# EAGLE design final_tank (EAGLE 9.6.2)
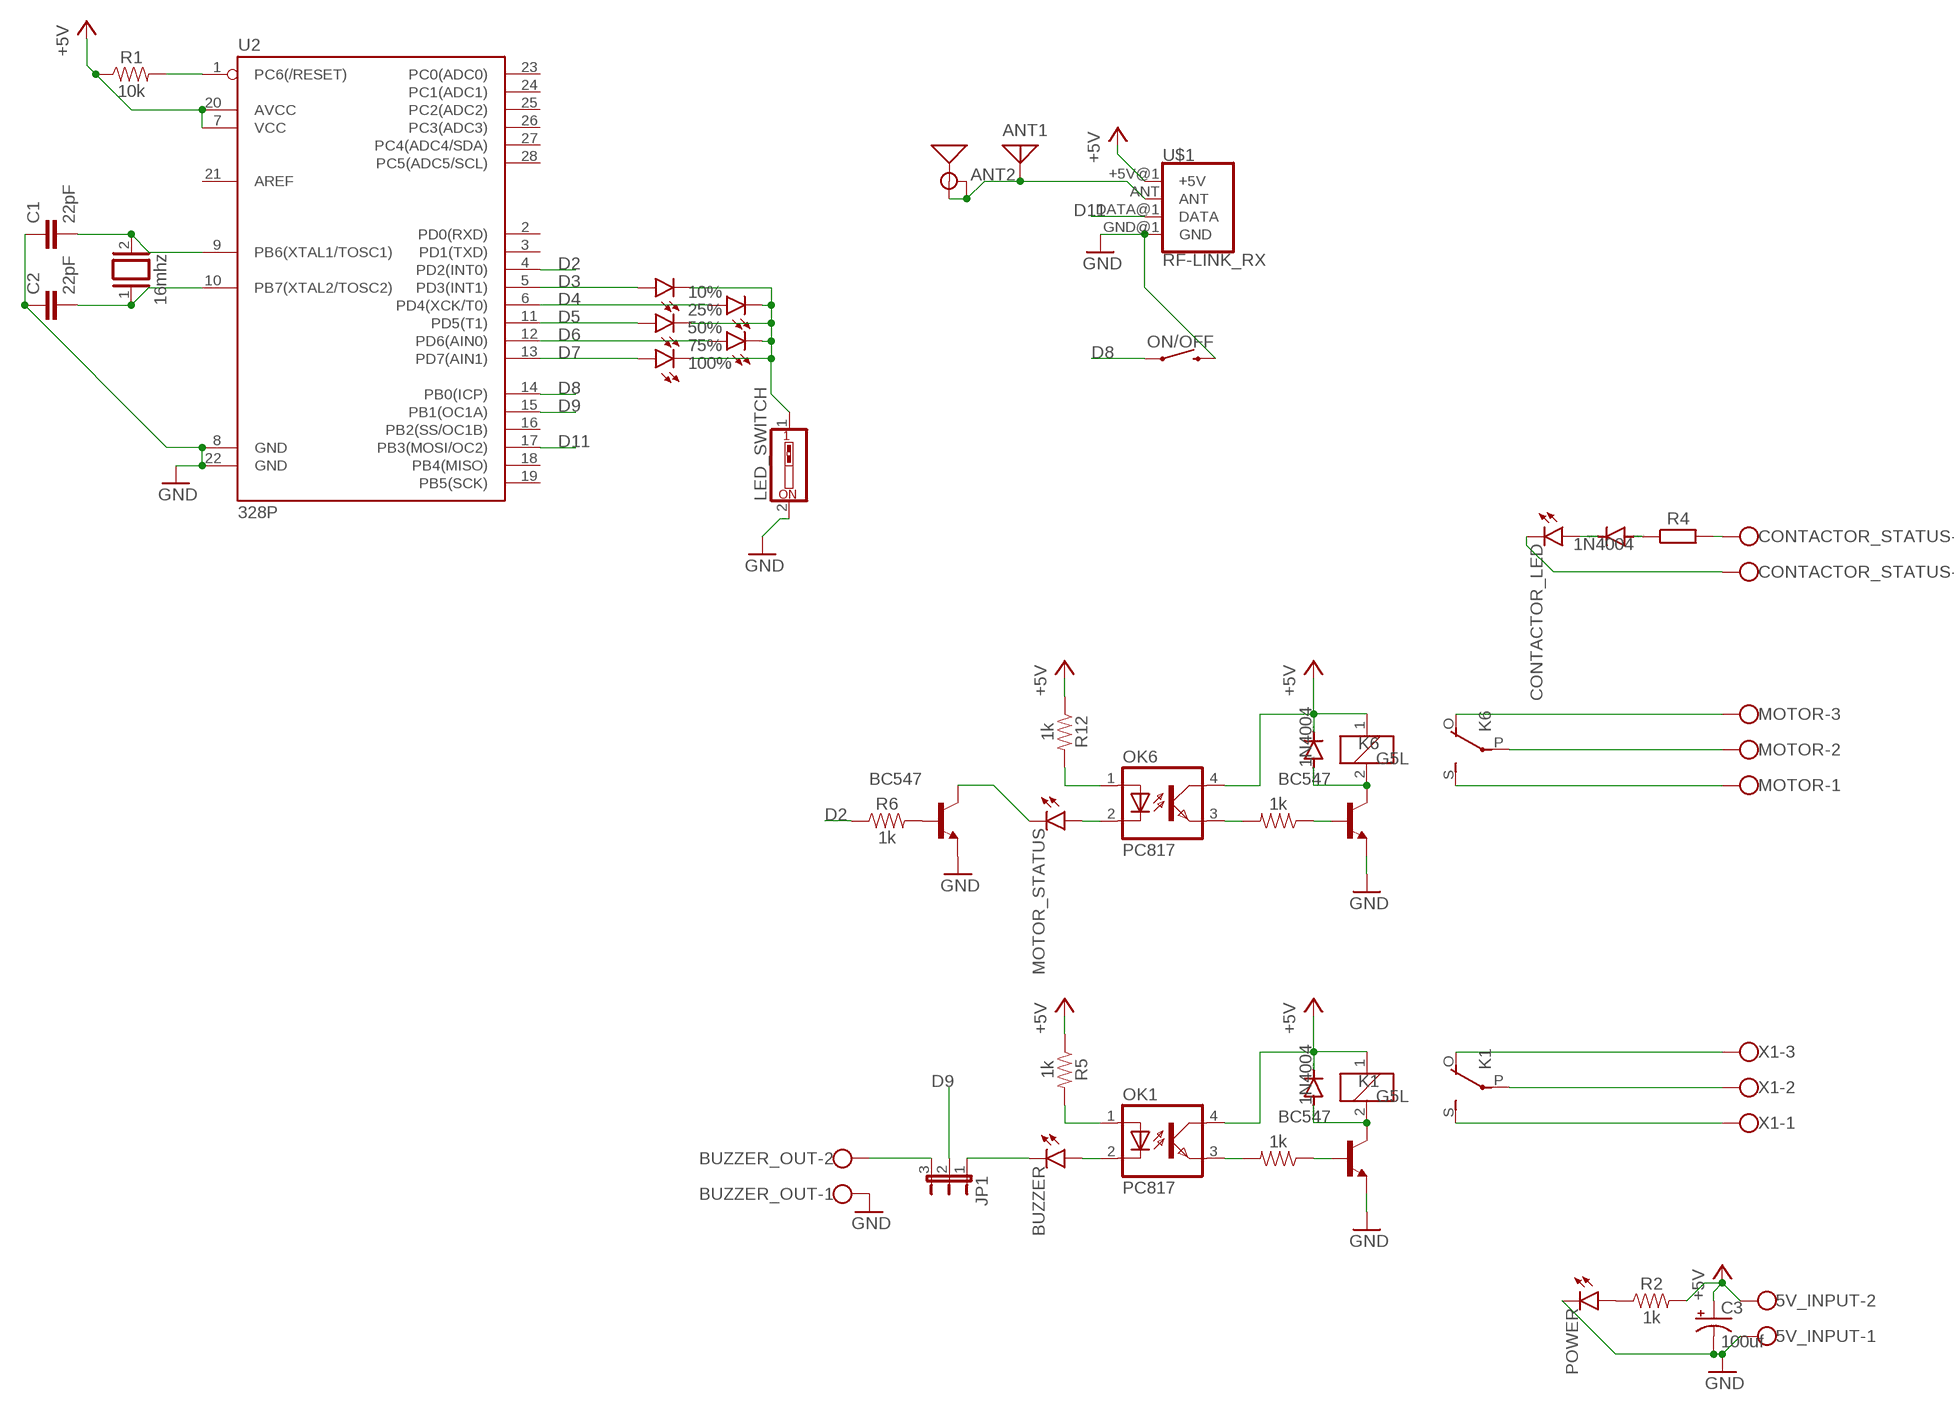
[diagram p0: schematic, sheet 1]

## Parts
5V_INPUT  W237-102  [W237-102]
10%  LED3MM  [LED3MM]
25%  LED3MM  [LED3MM]
50%  LED3MM  [LED3MM]
75%  LED3MM  [LED3MM]
100%  LED3MM  [LED3MM]
ANT1  ANTENNA  [PAD-01]
ANT2  ANTENNA-GROUNDEDTRACE-15.2MM  [TRACE_ANTENNA_2.4GHZ_15.2MM]
BUZZER  LED3MM  [LED3MM]
BUZZER_OUT  W237-102  [W237-102]
C1  22pF  22PF-PTH-2.54MM-200V-5%  [CAP-PTH-2.54]
C2  22pF  22PF-PTH-2.54MM-200V-5%  [CAP-PTH-2.54]
C3  100uf  1000UF-RADIAL-5MM-25V-20%  [CPOL-RADIAL-5MM-10MM]
CONTACTOR_LED  LED3MM  [LED3MM]
CONTACTOR_STATUS  W237-102  [W237-102]
D1  1N4004  [DO41-10]
D2  1N4004  [DO41-10]
D6  1N4004  [DO41-10]
JP1  JP2E  [JP2]
K1  G5L  [G5LE]
K6  G5L  [G5LE]
LED_SWITCH  SW_DIP-1  [EDG-01]
MOTOR  W237-103  [W237-103]
MOTOR_STATUS  LED3MM  [LED3MM]
OK1  PC817  [DIL04]
OK6  PC817  [DIL04]
ON/OFF  MOMENTARY-SWITCH-SPST-PTH-6.0MM  [TACTILE_SWITCH_PTH_6.0MM]
POWER  LED3MM  [LED3MM]
Q1  16mhz  XTAL/S  [QS]
R1  10k  1KOHM-HORIZ-1/4W-5%  [AXIAL-0.3]
R2  1k  1KOHM-HORIZ-1/4W-1%  [AXIAL-0.3]
R3  1k  1KOHM-HORIZ-1/4W-1%  [AXIAL-0.3]
R4  R_AXIAL-11.7MM-PITCH  [RESAD1176W63L850D250B]
R5  1k  1KOHM-HORIZ-1/4W-1%  [AXIAL-0.3]
R6  1k  1KOHM-HORIZ-1/4W-1%  [AXIAL-0.3]
R11  1k  1KOHM-HORIZ-1/4W-1%  [AXIAL-0.3]
R12  1k  1KOHM-HORIZ-1/4W-1%  [AXIAL-0.3]
T1  BC547  [TO92]
T2  BC547  [TO92]
T6  BC547  [TO92]
U2  328P  ATMEGA328P_PDIP  [DIP28]
U$1  RF-LINK_RX  [RF-LINK_RX]
X1  W237-103  [W237-103]

## Nets
+5V: 5V_INPUT.2 C3.+ R1.P$1 R2.P$2 U2.7(VCC) U2.20(AVCC) U$1.+5V@1(+5V)
D2: R6.P$1 U2.4(PD2(INT0))
D3: 10%.A U2.5(PD3(INT1))
D4: 25%.A U2.6(PD4(XCK/T0))
D5: 50%.A U2.11(PD5(T1))
D6: 75%.A U2.12(PD6(AIN0))
D7: 100%.A U2.13(PD7(AIN1))
D8: ON/OFF.1 U2.14(PB0(ICP))
D9: JP1.2 U2.15(PB1(OC1A))
D11: U2.17(PB3(MOSI/OC2)) U$1.DATA@1(DATA)
GND: 5V_INPUT.1 BUZZER_OUT.1 C1.1 C2.1 C3.- LED_SWITCH.2 ON/OFF.3 POWER.K(C) T1.1(E) T2.1(E) T6.1(E) U2.8(GND) U2.22(GND) U$1.GND@1(GND)
N$1: R1.P$2 U2.1(PC6(/RESET))
N$2: C1.2 Q1.2 U2.9(PB6(XTAL1/TOSC1))
N$3: C2.2 Q1.1 U2.10(PB7(XTAL2/TOSC2))
N$4: K6.P(2:P) MOTOR.2
N$5: POWER.A R2.P$1
N$6: D2.C D6.C K1.1 K6.1 OK1.4(COL) OK6.4(COL) R5.P$1 R12.P$1 ; supply symbol labelled +5V
N$7: D1.A R4.1
N$8: CONTACTOR_LED.A D1.C
N$9: CONTACTOR_STATUS.2 R4.2
N$10: CONTACTOR_LED.K(C) CONTACTOR_STATUS.1
N$11: 10%.K(C) 25%.K(C) 50%.K(C) 75%.K(C) 100%.K(C) LED_SWITCH.1
N$12: ANT1.1 ANT2.ANT(SIGNAL) ANT2.GND U$1.ANT
N$13: D2.A K1.2 T1.3(C)
N$14: R3.P$1 T1.2(B)
N$15: OK1.3(EMIT) R3.P$2
N$16: BUZZER.A OK1.2(C)
N$17: OK1.1(A) R5.P$2
N$18: K1.O(2:O) X1.3
N$19: K1.S(2:S) X1.1
N$20: K1.P(2:P) X1.2
N$21: R6.P$2 T2.2(B)
N$22: MOTOR_STATUS.K(C) T2.3(C)
N$23: BUZZER_OUT.2 JP1.3
N$24: BUZZER.K(C) JP1.1
N$43: D6.A K6.2 T6.3(C)
N$44: R11.P$1 T6.2(B)
N$45: OK6.3(EMIT) R11.P$2
N$46: MOTOR_STATUS.A OK6.2(C)
N$47: OK6.1(A) R12.P$2
N$49: K6.O(2:O) MOTOR.3
N$50: K6.S(2:S) MOTOR.1
Unconnected: U2.2(PD0(RXD)) U2.3(PD1(TXD)) U2.16(PB2(SS/OC1B)) U2.18(PB4(MISO)) U2.19(PB5(SCK)) U2.21(AREF) U2.23(PC0(ADC0)) U2.24(PC1(ADC1)) U2.25(PC2(ADC2)) U2.26(PC3(ADC3)) U2.27(PC4(ADC4/SDA)) U2.28(PC5(ADC5/SCL))

## Library data of the parts
5V_INPUT BUZZER_OUT CONTACTOR_STATUS = con-wago-500:W237-102: WAGO SCREW CLAMP; MPN: 237-102; OC_FARNELL: unknown; OC_NEWARK: 70K9898
10% 25% 50% 75% 100% BUZZER CONTACTOR_LED MOTOR_STATUS POWER = led:LED: LED OSRAM: - CHIPLED LG R971, LG N971, LY N971, LG Q971, LY Q971, LO R971, LY R971 LH N974, LH R974 LS Q976, LO Q976, LY Q976 LO Q996 - Hyper CHIPLED LW Q18S LB Q993, LB Q99A, LB R99A - SideLED LS A670, LO A670, LY A670, LG A670, LP A670 LB A673, LV A673, LT A673, LW A673 LH A674 LY A675 LS A676, LA A676, LO A676, LY A676, LW A676 LS A679, LY A679, LG A679 - Hyper Micro SIDELED® LS Y876, LA Y876, LO Y876, LY Y876 LT Y87S - SmartLED LW L88C, LW L88S LB L89C, LB L89S, LG L890 LS L89K, LO L89K, LY L89K LS L896, LA L896, LO L896, LY L896 - TOPLED LS T670, LO T670, LY T670, LG T670, LP T670 LSG T670, LSP T670, LSY T670, LOP T670, LYG T670 LG T671, LOG T671, LSG T671 LB T673, LV T673, LT T673, LW T673 LH T674 LS T676, LA T676, LO T676, LY T676, LB T676, LH T676, LSB T676, LW T676 LB T67C, LV T67C, LT T67C, LS T67K, LO T67K, LY T67K, LW E67C LS E67B, LA E67B, LO E67B, LY E67B, LB E67C, LV E67C, LT E67C LW T67C LS T679, LY T679, LG T679 LS T770, LO T770, LY T770, LG T770, LP T770 LB T773, LV T773, LT T773, LW T773 LH T774 LS E675, LA E675, LY E675, LS T675 LS T776, LA T776, LO T776, LY T776, LB T776 LHGB T686 LT T68C, LB T68C - Hyper Mini TOPLED® LB M676 - Mini TOPLED Santana® LG M470 LS M47K, LO M47K, LY M47K Source: http://www.osram.convergy.de LUXEON: - LUMILED® LXK2-PW12-R00, LXK2-PW12-S00, LXK2-PW14-U00, LXK2-PW14-V00 LXK2-PM12-R00, LXK2-PM12-S00, LXK2-PM14-U00 LXK2-PE12-Q00, LXK2-PE12-R00, LXK2-PE12-S00, LXK2-PE14-T00, LXK2-PE14-U00 LXK2-PB12-K00, LXK2-PB12-L00, LXK2-PB12-M00, LXK2-PB14-N00, LXK2-PB14-P00, LXK2-PB14-Q00 LXK2-PR12-L00, LXK2-PR12-M00, LXK2-PR14-Q00, LXK2-PR14-R00 LXK2-PD12-Q00, LXK2-PD12-R00, LXK2-PD12-S00 LXK2-PH12-R00, LXK2-PH12-S00 LXK2-PL12-P00, LXK2-PL12-Q00, LXK2-PL12-R00 Source: www.luxeon.com KINGBRIGHT: KA-3528ASYC Source: www.kingbright.com
ANT1 = discrete:ANTENNA: Antenna
ANT2 = SparkFun-RF:ANTENNA-GROUNDED: Antenna w/ Ground Connection 2.4GHz antennae with signal and ground terminals. TRACE_ANTENNA_2.4GHZ_15.2MM - Meander Trace antenna 15.2 x 5.7mm footprint Based on layout from TI app note AN043 <http://www.ti.com/lit/an/swra117d/swra117d.pdf>. TRACE_ANTENNA_2.4GHZ_25.7MM - Inverted F trace antenna 25.7 x 7.5 mm footprint. Based on layout from TI design note DN0007 <http://www.ti.com/lit/an/swru120b/swru120b.pdf>.
C1 C2 = SparkFun-Capacitors:22PF: 22pF ceramic capacitors A capacitor is a passive two-terminal electrical component used to store electrical energy temporarily in an electric field.; PROD_ID: CAP-09128
C3 = SparkFun-Capacitors:1000UF: 1,000µF/1mF ceramic capacitors A capacitor is a passive two-terminal electrical component used to store electrical energy temporarily in an electric field. CAP-08070; PROD_ID: CAP-09538; VALUE: 1mF
D1 D2 D6 = diode:1N4004: DIODE general purpose rectifier, 1 A
JP1 = jumper:JP2E: JUMPER
K1 K6 = relay:G5L: RELAY 1 x switch, 10 A/120 V AC, 8 A/30 V ADC, Omron; OC_FARNELL: unknown; OC_NEWARK: unknown
LED_SWITCH = special:SW_DIP-1: DIP SWITCH
MOTOR X1 = con-wago-500:W237-103: WAGO SCREW CLAMP; MPN: 237-103; OC_FARNELL: unknown; OC_NEWARK: 18M7116
OK1 OK6 = optocoupler:PC817: SHARP OPTO COUPLER; MPN: PC817X4J000F; OC_FARNELL: 9707727; OC_NEWARK: 97K7059
ON/OFF = SparkFun-Switches:MOMENTARY-SWITCH-SPST: Momentary Switch (Pushbutton) - SPST Normally-open (NO) SPST momentary switches (buttons, pushbuttons). Variants PTH-12MM - 12mm square, through-hole Momentary Pushbutton Switch - 12mm Square <https://www.sparkfun.com/products/9190> (COM-09190) PTH-6.0MM, PTH-6.0MM-KIT - 6.0mm square, through-hole Mini Pushbutton Switch <https://www.sparkfun.com/products/97> (COM-00097) KIT package intended for soldering kit's - only one side of pads' copper is exposed. PTH-RIGHT-ANGLE-KIT - Right-angle, through-hole Right Angle Tactile Button <https://www.sparkfun.com/products/10791> - Used on SparkFun BigTime Watch Kit <https://www.sparkfun.com/products/11734> SMD-12MM - 12mm square, surface-mount Tactile Button - SMD (12mm) <https://www.sparkfun.com/products/12993> (COM-12993) Used on SparkFun PicoBoard <https://www.sparkfun.com/products/11888> SMD-4.5MM - 4.5mm Square Trackball Switch Used on SparkFun Blackberry Trackballer Breakout <https://www.sparkfun.com/products/13169> SMD-4.6MMX2.8MM - 4.60mm x 2.80mm, surface mount Used on SparkFun SAMD21 Mini Breakout <https://www.sparkfun.com/products/13664> SMD-5.2MM, SMD-5.2-REDUNDANT - 5.2mm square, surface-mount Mini Pushbutton Switch - SMD <https://www.sparkfun.com/products/8720> (COM-08720) Used on Arduino Pro Mini <https://www.sparkfun.com/products/11114> REDUNDANT package connects both switch circuits together SMD-6.0X3.5MM - 6.0 x 3.5mm, surface mount Momentary Reset Switch SMD <https://www.sparkfun.com/products/8229> (COM-08229) SMD-6.2MM-TALL - 6.2mm square, surface mount Tactile Button - SMD (6mm) <https://www.sparkfun.com/products/12992> Used on SparkFun Digital Sandbox <https://www.sparkfun.com/products/12651> SMD-RIGHT-ANGLE - Right-angle, surface mount Used on SparkFun Block for Intel® Edison - Arduino <https://www.sparkfun.com/products/13036>; PROD_ID: SWCH-08441; SF_SKU: COM-00097
Q1 = special:XTAL/S: CRYSTAL
R1 = SparkFun-Resistors:1KOHM: 1kΩ resistor A resistor is a passive two-terminal electrical component that implements electrical resistance as a circuit element. Resistors act to reduce current flow, and, at the same time, act to lower voltage levels within circuits. - Wikipedia; PROD_ID: RES-08380; VALUE: 1k
R2 R3 R5 R6 R11 R12 = SparkFun-Resistors:1KOHM: 1kΩ resistor A resistor is a passive two-terminal electrical component that implements electrical resistance as a circuit element. Resistors act to reduce current flow, and, at the same time, act to lower voltage levels within circuits. - Wikipedia; PROD_ID: RES-12182
R4 = Resistor:R: Resistor Fixed - Generic; CATEGORY: Resistor; SUB-CATEGORY: Fixed
T1 T2 T6 = transistor:BC547: NPN TRANSISTOR
U2 = SparkFun-IC-Microcontroller:ATMEGA328P_PDIP: Atmel 328P Through hole ATMEGA328P uC used in the Arduino 32kb flash, 1k EEPROM, 2k SRAM Datasheet <http://www.sparkfun.com/datasheets/Components/SMD/ATMega328.pdf> SparkFun Products Storefront component: AVR 28 Pin 20MHz 32K 6A/D - ATMega328P <https://www.sparkfun.com/products/9061> (COM-09061) SparkFun Simon Says - Through-Hole Soldering Kit <https://www.sparkfun.com/products/10547> (KIT-10547) SparkFun Learn to Solder - Simon Says <https://www.sparkfun.com/products/13708> (KIT-13708) SparkFun BigTime Watch Kit <https://www.sparkfun.com/products/11734> (KIT-11734) SparkFun ClockIt <https://www.sparkfun.com/products/10930> (KIT-10930) SparkFun Serial Enabled LCD Kit <https://www.sparkfun.com/products/10097> (LCD-10097) SparkFun Simon Tilts - Through Hole Soldering Kit <https://www.sparkfun.com/products/12634> (KIT-12634) SparkFun Frequency Counter Kit <https://www.sparkfun.com/products/10140> (KIT-10140) FabFM Radio Kit <https://www.sparkfun.com/products/11043> (KIT-11043) SparkFun Binary Blaster Kit <https://www.sparkfun.com/products/12037> (KIT-12037) SparkFun Metro-Gnome <https://www.sparkfun.com/products/9236> (KIT-09236) ATmega328 with Arduino Optiboot (Uno) <https://www.sparkfun.com/products/10524> (DEV-10524); PROD_ID: IC-09136
U$1 = SparkFun-RF:RF-LINK_RX: RF Link Receiver (434 MHz, 315 MHz) These wireless receivers work with equivalent transmitters. They can easily fit into a breadboard and work well with microcontrollers to create a very simple wireless data link. Since these are only receivers, they will only work communicating data one-way, you would need two pairs (of different frequencies) to act as a transmitter/receiver pair.. SparkFun Products RF Link Receiver - 4800bps (434 MHz) <https://www.sparkfun.com/products/10532>(WRL-10532); SF_ID: WRL-10533

## Net classes
0 default: width 0.711 mm, clearance 0.457 mm

## Board
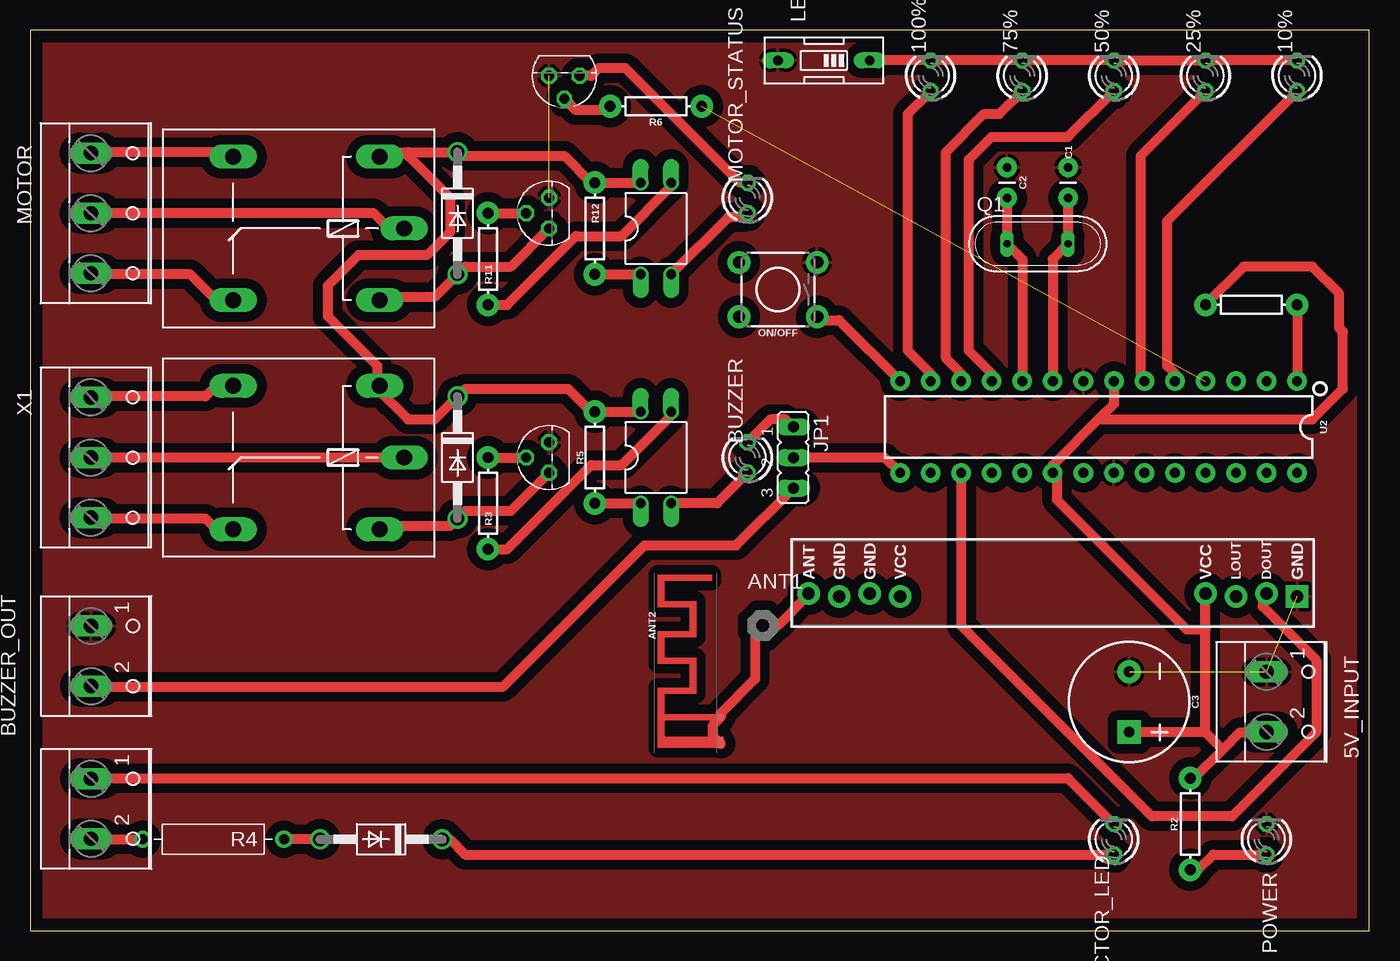
[diagram p1: board, top side]

Size 111.43 x 74.92 mm. Coordinates in mm from the lower left corner, seen from the top.
Outline: 0,0 111.43,0 111.43,74.92 0,74.92 0,0
Copper layers (1*16): Top 0.035mm / dielectric 1.5mm / Bottom 0.035mm
Design rules "default *": minimum track width 32mil, minimum drill 0.35mm, track to track 32mil, track to pad 32mil, pad to pad 32mil, via to via 32mil, smd to smd 6mil, copper to edge 40mil, drill to drill 6mil, minimum pad ring 10mil, minimum via ring 8mil, stop-mask expansion 4mil, vias tented up to drill 0mil, thermal gap 12mil

### Footprints (pad centres in the part's own frame; a part is rotated, then mirrored left to right if it is on the bottom)
W237-102 = drill 1.194 long: 1 -2.5,-1.27; 2 2.5,-1.27
LED3MM = drill 0.813 octagon: A -1.27,0; K 1.27,0
PAD-01 = drill 1.321 pad 2.54 octagon: 1 0,0
TRACE_ANTENNA_2.4GHZ_15.2MM = smd 0.5 x 0.5: ANT 0,-0.25 | smd 0.9 x 0.5: GND -2.1,-0.25
CAP-PTH-2.54 = drill 0.7 pad 1.651: 1 -1.27,0; 2 1.27,0
CPOL-RADIAL-5MM-10MM = drill 0.9 pad 1.93 square: + 2.5,0 | drill 0.9 pad 1.93: - -2.5,0
DO41-10 = drill 1.118: A 5.08,0; C -5.08,0
JP2 = drill 0.914 long: 1 -2.54,0; 2 0,0; 3 2.54,0
G5LE = drill 1.321 long: 1 -7.493,-5.969; 2 -7.493,5.969; O 4.699,5.969; P -9.525,0; S 4.699,-5.969
EDG-01 = drill 0.813 long: 1 0,-3.81; 2 0,3.81
W237-103 = drill 1.194 long: 1 -5,-1.29; 2 0,-1.29; 3 5,-1.29
DIL04 = drill 0.813 offset: 1 -1.27,-3.81; 2 1.27,-3.81; 3 1.27,3.81; 4 -1.27,3.81
TACTILE_SWITCH_PTH_6.0MM = drill 1.016 pad 1.88: 1 -3.251,2.261; 2 3.251,2.261; 3 -3.251,-2.261; 4 3.251,-2.261
QS = drill 0.61 long: 1 -2.54,0; 2 2.54,0
AXIAL-0.3 = drill 0.9 pad 1.88: P$1 -3.81,0; P$2 3.81,0
RESAD1176W63L850D250B = drill 0.83 pad 1.43: 1 -5.88,0; 2 5.88,0
TO92 = drill 0.813 octagon: 1 1.27,0; 2 0,1.905; 3 -1.27,0
DIP28 = drill 0.813 pad 1.626: 1 -16.51,-3.81; 2 -13.97,-3.81; 3 -11.43,-3.81; 4 -8.89,-3.81; 5 -6.35,-3.81; 6 -3.81,-3.81; 7 -1.27,-3.81; 8 1.27,-3.81; 9 3.81,-3.81; 10 6.35,-3.81; 11 8.89,-3.81; 12 11.43,-3.81; 13 13.97,-3.81; 14 16.51,-3.81; 15 16.51,3.81; 16 13.97,3.81; 17 11.43,3.81; 18 8.89,3.81; 19 6.35,3.81; 20 3.81,3.81; 21 1.27,3.81; 22 -1.27,3.81; 23 -3.81,3.81; 24 -6.35,3.81; 25 -8.89,3.81; 26 -11.43,3.81; 27 -13.97,3.81; 28 -16.51,3.81
RF-LINK_RX = drill 1.016 pad 1.88: +5V@1 -12.7,-0.127; +5V@2 12.7,0.127; ANT 20.32,-0.127; DATA@1 -17.78,-0.127; DATA@2 -15.24,0.127; GND@2 15.24,-0.127; GND@3 17.78,0.127 | drill 1.016 pad 1.88 square: GND@1 -20.32,0.127

### Placement (x,y rotation side)
5V_INPUT  104.14,19.05 270 top
10%  105.41,71.12 90 top
25%  97.79,71.12 90 top
50%  90.17,71.12 90 top
75%  82.55,71.12 90 top
100%  74.93,71.12 90 top
ANT1  60.96,25.4 0 top
ANT2  57.15,17.78 90 top
BUZZER  59.69,39.37 90 top
BUZZER_OUT  6.35,22.86 270 top
C1  86.36,62.23 270 top
C2  81.28,62.23 270 top
C3  91.44,19.05 270 top
CONTACTOR_LED  90.17,7.62 90 top
CONTACTOR_STATUS  6.35,10.16 270 top
D1  29.21,7.62 180 top
D2  35.56,39.37 270 top
D6  35.56,59.69 270 top
JP1  63.5,39.37 270 top
K1  21.59,39.37 180 top
K6  21.59,58.42 180 top
LED_SWITCH  66.04,72.39 90 top
MOTOR  6.35,59.69 270 top
MOTOR_STATUS  59.69,60.96 90 top
OK1  52.07,39.37 0 top
OK6  52.07,58.42 0 top
ON/OFF  62.23,53.34 180 top
POWER  102.87,7.62 90 top
Q1  83.82,57.15 0 top
R1  101.6,52.07 0 top
R2  96.52,8.89 90 top
R3  38.1,35.56 270 top
R4  15.24,7.62 180 top
R5  46.99,39.37 270 top
R6  52.07,68.58 180 top
R11  38.1,55.88 270 top
R12  46.99,58.42 270 top
T1  43.18,39.37 90 top
T2  44.45,71.12 180 top
T6  43.18,59.69 90 top
U2  88.9,41.91 180 top
U$1  85.09,27.94 180 top
X1  6.35,39.37 270 top

### Tracks (layer width: path | path; a pad name or v marks a point on that pad's centre or on a via)
+5V
  Top 0.813: 99.22,15.08 96.84,12.7 R2.P$2 | 99.22,15.08 100.65,16.51 102.87,16.51 5V_INPUT.2 | 97.79,16.51 97.79,25.08 | 97.79,25.08 U$1.+5V@1 | 99.22,15.08 97.79,16.51 | 97.79,16.51 91.44,16.51 C3.+ | 89.06,42.7 90.17,43.82 U2.7 | 89.06,42.7 85.09,38.73 U2.20 85.41,38.1 85.41,35.88 96.2,25.08 97.79,25.08 | R1.P$1 100.97,55.25 106.68,55.25 108.9,53.02 108.9,50.16 109.22,49.85 109.22,45.09 106.68,42.55 89.22,42.55 89.06,42.7
D2  (1 unrouted)
D3
  Top 0.813: 10%.A 94.62,59.06 94.62,46.99 95.25,46.36 U2.5
D4
  Top 0.813: 25%.A 92.39,64.45 92.39,46.36 92.71,46.04 U2.6
D5
  Top 0.813: 50%.A 86.36,66.04 80.01,66.04 78.1,64.14 78.1,48.26 80.01,46.36 U2.11
D6
  Top 0.813: 75%.A 80.65,67.95 79.38,67.95 76.2,64.77 76.2,47.62 77.47,46.36 U2.12
D7
  Top 0.813: 100%.A 73.03,67.95 73.03,48.26 74.93,46.36 U2.13
D8
  Top 0.813: U2.14 67.31,50.8 65.72,50.8 ON/OFF.1
D9
  Top 0.813: JP1.2 71.12,39.37 U2.15
D11
  Top 0.813: U2.17 77.47,25.4 93.34,9.53 100.01,9.53 107,16.51 107,22.54 102.55,26.99 102.55,27.94 102.87,28.26 U$1.DATA@1
GND  (3 unrouted)
  pour Top: 0,74.93 0,0 111.76,0 111.76,74.93
N$1
  Top 0.813: R1.P$2 U2.1
N$2
  Top 0.813: C1.2 Q1.2 85.09,55.88 U2.9
N$3
  Top 0.813: C2.2 Q1.1 82.55,55.88 U2.10
N$4
  Top 0.813: MOTOR.2 28.57,59.69 29.84,58.42 K6.P
N$5
  Top 0.813: POWER.A 98.43,6.35 97.16,5.08 R2.P$1
N$6
  Top 0.813: OK1.4 R5.P$1 46.67,43.18 44.77,45.09 36.2,45.09 D2.C 33.66,42.55 31.43,42.55 28.89,45.09 K1.1 28.89,45.72 28.89,46.99 24.77,51.12 24.77,53.66 27.3,56.2 33.02,56.2 34.92,58.1 34.92,60.96 31.43,64.45 31.43,64.77 | OK6.4 R12.P$1 46.67,62.23 44.45,64.45 35.56,64.45 D6.C 31.43,64.77 | 31.43,64.77 29.53,64.77 29.21,64.45 K6.1
N$7
  Top 0.813: D1.A R4.1
N$8
  Top 0.813: CONTACTOR_LED.A 36.2,6.35 34.92,7.62 D1.C
N$9
  Top 0.813: R4.2 5.08,7.62 CONTACTOR_STATUS.2
N$10
  Top 0.813: CONTACTOR_LED.K 86.36,12.7 5.08,12.7 CONTACTOR_STATUS.1
N$11
  Top 0.813: 10%.K 25%.K 50%.K 75%.K 100%.K LED_SWITCH.1
N$12
  Top 0.813: 57.47,17.78 56.83,17.15 56.83,16.19 57.47,15.56 ANT2.GND | 57.47,17.78 ANT2.ANT | 57.47,17.78 57.47,18.1 60.33,20.95 60.33,24.77 ANT1.1 62.23,25.4 64.77,27.94 U$1.ANT
N$13
  Top 0.813: T1.3 40,34.93 36.2,34.93 D2.A 34.92,33.66 29.21,33.66 K1.2
N$14
  Top 0.813: R3.P$1 T1.2
N$15
  Top 0.813: OK1.3 53.34,42.86 49.21,38.73 46.67,38.73 39.69,31.75 R3.P$2
N$16
  Top 0.813: OK1.2 57.15,35.56 BUZZER.A
N$17
  Top 0.813: R5.P$2 OK1.1
N$18
  Top 0.813: X1.3 5.08,34.29 14.61,34.29 15.24,33.66 16.83,33.66 K1.O
N$19
  Top 0.813: X1.1 5.08,44.45 14.61,44.45 15.24,45.09 16.83,45.09 K1.S
N$20
  Top 0.813: K1.P X1.2
N$21
  Top 0.813: T2.2 45.4,68.26 47.94,68.26 R6.P$2
N$22
  Top 0.813: T2.3 46.67,71.12 47.31,71.75 49.53,71.75 59.05,62.23 MOTOR_STATUS.K
N$23
  Top 0.813: JP1.3 58.74,32.07 51.12,32.07 39.37,20.32 5.08,20.32 BUZZER_OUT.2
N$24
  Top 0.813: BUZZER.K 61.59,42.55 62.87,42.55 JP1.1
N$43
  Top 0.813: T6.3 40,55.25 36.2,55.25 D6.A 33.66,52.7 29.21,52.7 K6.2
N$44
  Top 0.813: R11.P$1 T6.2
N$45
  Top 0.813: OK6.3 53.34,61.91 49.21,57.79 45.4,57.79 39.69,52.07 R11.P$2
N$46
  Top 0.813: OK6.2 58.1,59.37 59.37,59.37 MOTOR_STATUS.A
N$47
  Top 0.813: R12.P$2 OK6.1
N$49
  Top 0.813: MOTOR.3 5.08,54.61 13.33,54.61 15.24,52.7 16.83,52.7 K6.O
N$50
  Top 0.813: K6.S 16.51,64.77 5.08,64.77 MOTOR.1